# EasyEDA schematic Master System Converter Plus.json
TITLE: Sheet_1; REV: 1.0; Date: 2022-09-26; Sheet: 1/1; Drawn By: Pilou95; Company: Your Company
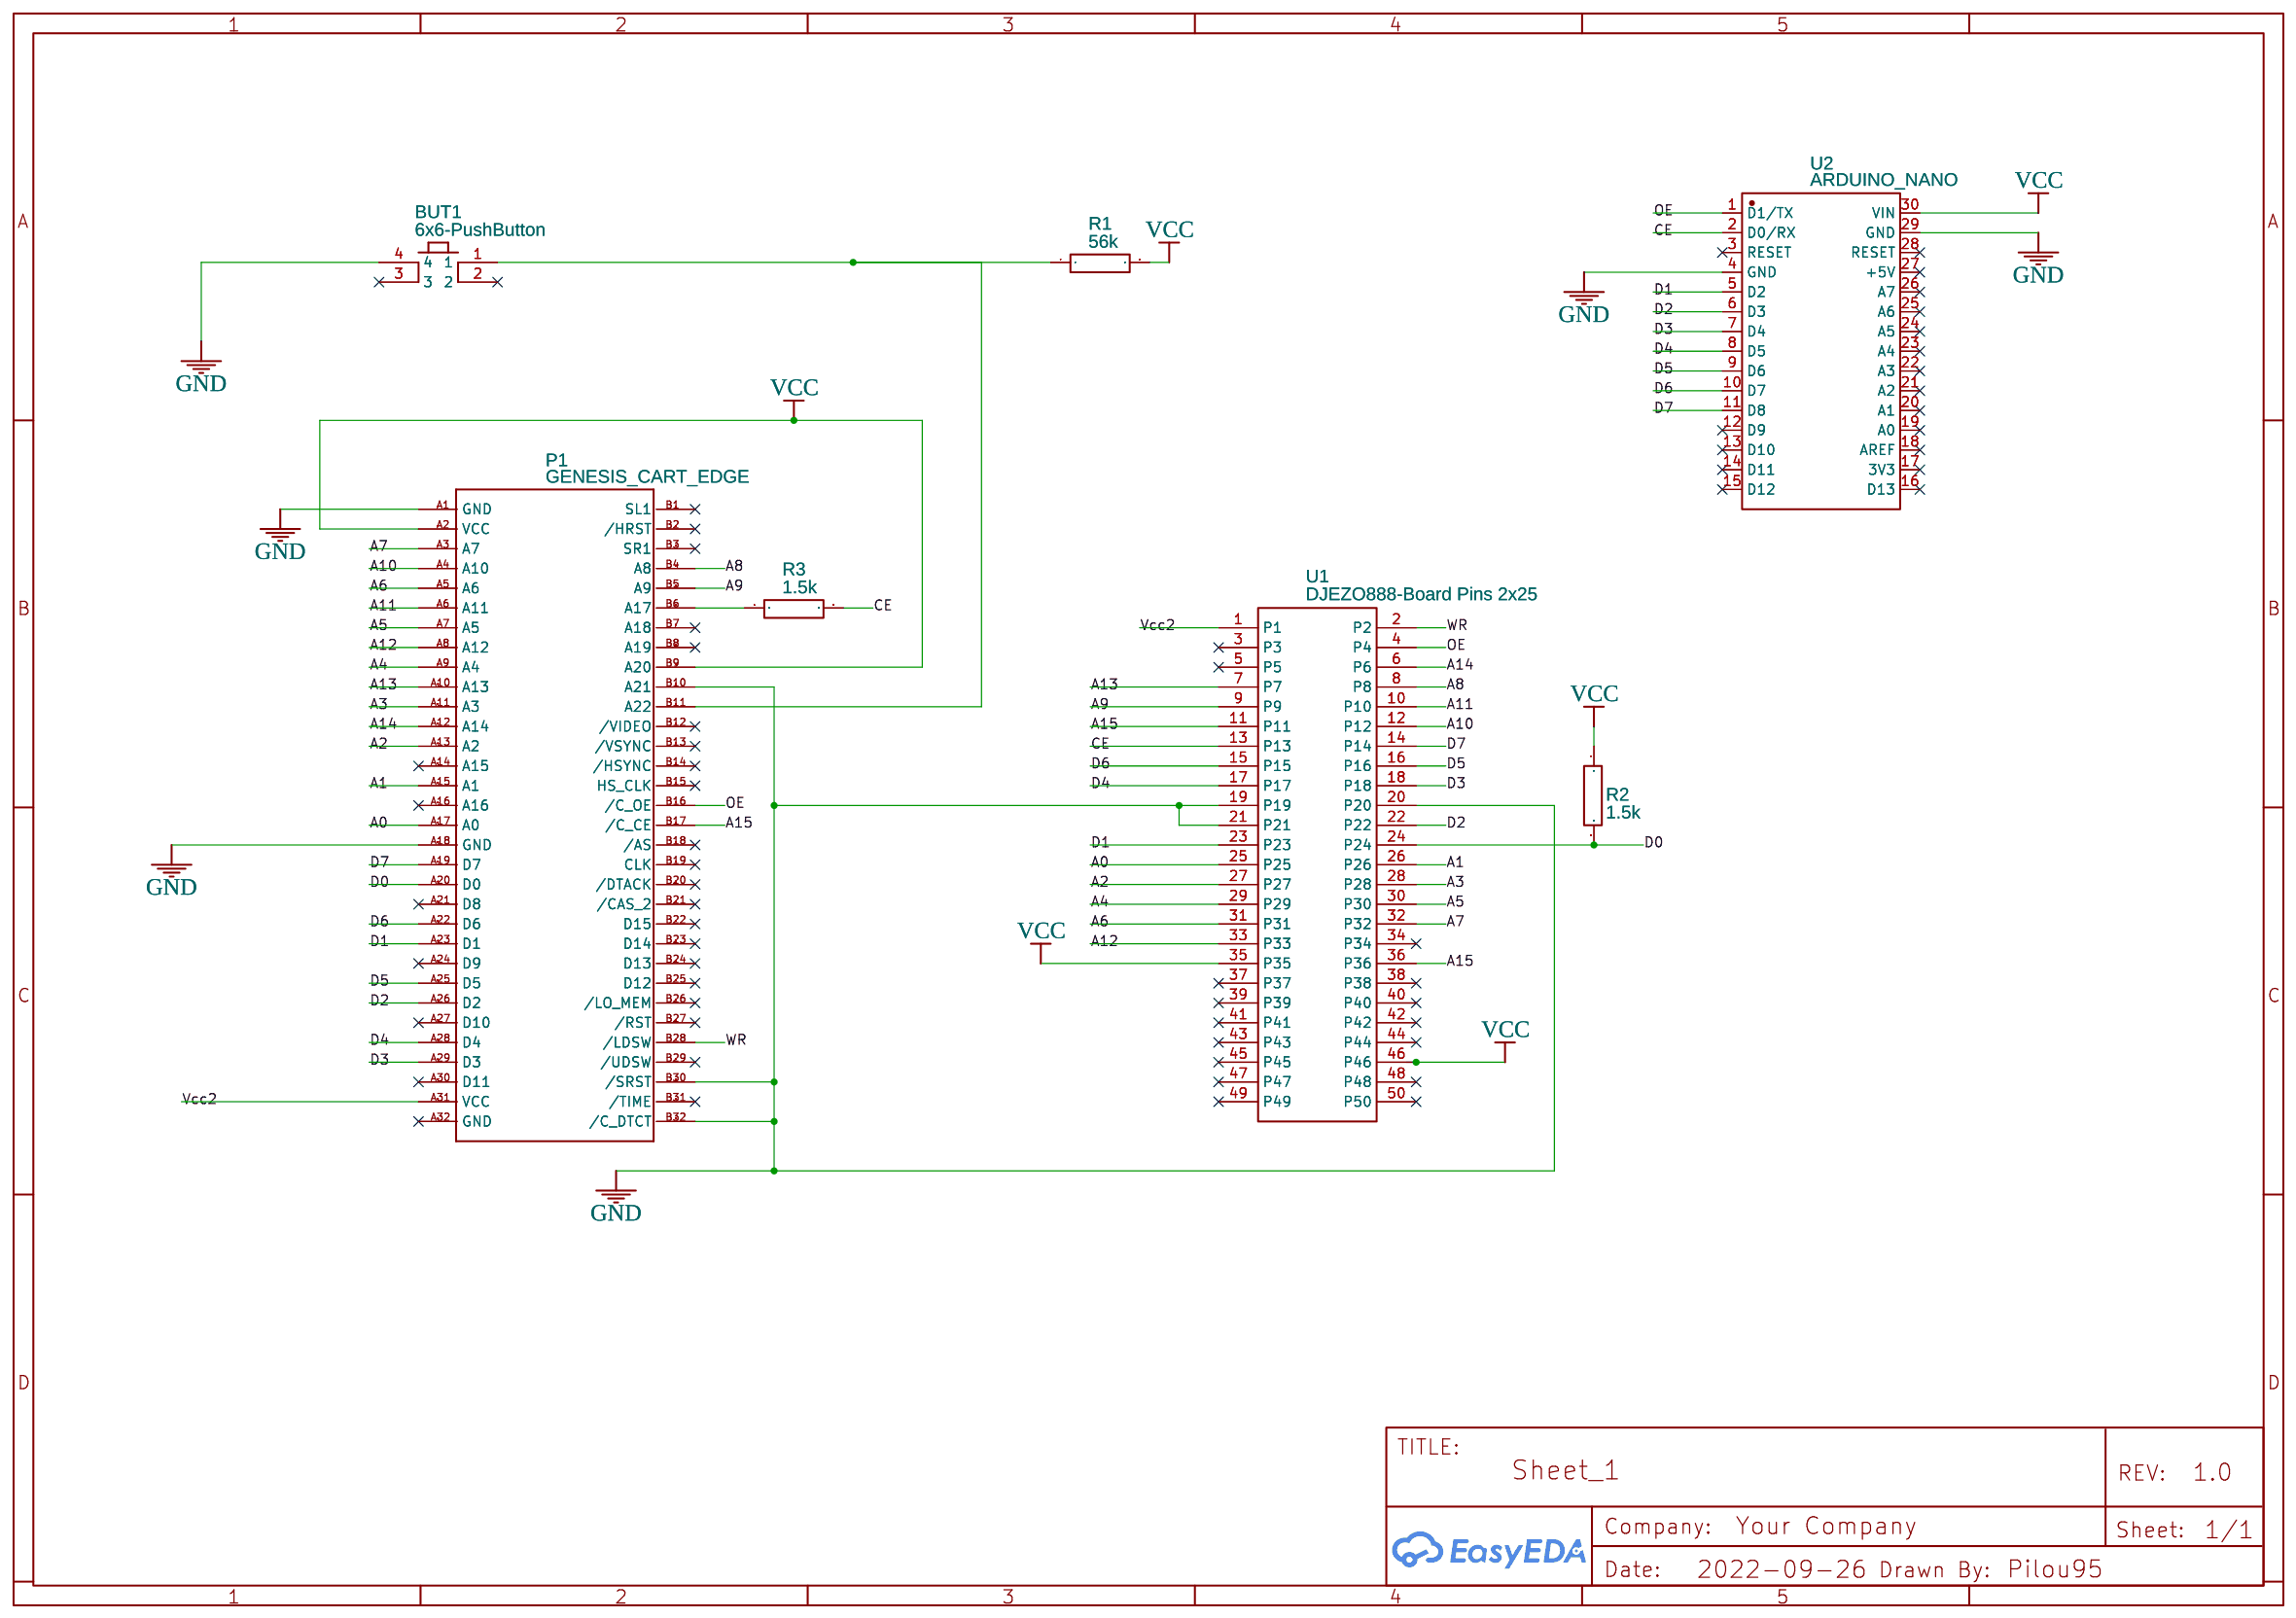
[diagram p0: schematic sheet]

## Parts
BUT1  6x6-PushButton  [6X6-PUSHBUTTON]
P1  GENESIS_CART_EDGE  [GENESIS_CART_EDGE]
R1  56k  [RESISTANCE]
R2  1.5k  [RESISTANCE]
R3  1.5k  [RESISTANCE]
U1  DJEZO888-Board Pins 2x25  [DJEZO888-2X25 CARD EDGE 2.54]
U2  ARDUINO_NANO  [COMM-TH_ARDUINO_NANO]

## Library data of the parts
BUT1 = 6x6-PushButton: Contributor: peinadolopezvictor
P1 = GENESIS_CART_EDGE: Contributor: Donie1704
R1-R3 = resistance: Contributor: ludoslash
U1 = DJEZO888-Board Pins 2x25: Contributor: djezo888
U2 = ARDUINO_NANO: Supplier: LCSC; Supplier Part: C9900017879; Manufacturer: null; JLCPCB Part Class: Extended Part; Contributor: lcsc

## Nets
GND: BUT1.4 P1.A1(GND) P1.A18(GND) P1.B10(A21) P1.B30(/SRST) P1.B32(/C_DTCT) U1.19(P19) U1.20(P20) U1.21(P21) U2.4(GND) U2.29(GND)
VCC: P1.A2(VCC) P1.B9(A20) R1.2 R2.1 U1.35(P35) U1.46(P46) U2.30(VIN)
Vcc2: P1.A31(VCC) U1.1(P1)
A0: P1.A17(A0) U1.25(P25)
A1: P1.A15(A1) U1.26(P26)
A2: P1.A13(A2) U1.27(P27)
A3: P1.A11(A3) U1.28(P28)
A4: P1.A9(A4) U1.29(P29)
A5: P1.A7(A5) U1.30(P30)
A6: P1.A5(A6) U1.31(P31)
A7: P1.A3(A7) U1.32(P32)
A8: P1.B4(A8) U1.8(P8)
A9: P1.B5(A9) U1.9(P9)
A10: P1.A4(A10) U1.12(P12)
A11: P1.A6(A11) U1.10(P10)
A12: P1.A8(A12) U1.33(P33)
A13: P1.A10(A13) U1.7(P7)
A14: P1.A12(A14) U1.6(P6)
A15: P1.B17(/C_CE) U1.11(P11) U1.36(P36)
CE: R3.2 U1.13(P13) U2.2(D0/RX)
D0: P1.A20(D0) R2.2 U1.24(P24)
D1: P1.A23(D1) U1.23(P23) U2.5(D2)
D2: P1.A26(D2) U1.22(P22) U2.6(D3)
D3: P1.A29(D3) U1.18(P18) U2.7(D4)
D4: P1.A28(D4) U1.17(P17) U2.8(D5)
D5: P1.A25(D5) U1.16(P16) U2.9(D6)
D6: P1.A22(D6) U1.15(P15) U2.10(D7)
D7: P1.A19(D7) U1.14(P14) U2.11(D8)
OE: P1.B16(/C_OE) U1.4(P4) U2.1(D1/TX)
WR: P1.B28(/LDSW) U1.2(P2)
Net-(BUT1-1): BUT1.1 P1.B11(A22) R1.1
Net-(P1-B6): P1.B6(A17) R3.1

Not connected (* = marked no-connect by the designer): BUT1 2* 3*; P1 A14(A15)* A16* A21(D8)* A24(D9)* A27(D10)* A30(D11)* A32(GND)* B1(SL1)* B2(/HRST)* B3(SR1)* B7(A18)* B8(A19)* B12(/VIDEO)* B13(/VSYNC)* B14(/HSYNC)* B15(HS_CLK)* B18(/AS)* B19(CLK)* B20(/DTACK)* B21(/CAS_2)* B22(D15)* B23(D14)* B24(D13)* B25(D12)* B26(/LO_MEM)* B27(/RST)* B29(/UDSW)* B31(/TIME)*; U1 3(P3)* 5(P5)* 34(P34)* 37(P37)* 38(P38)* 39(P39)* 40(P40)* 41(P41)* 42(P42)* 43(P43)* 44(P44)* 45(P45)* 47(P47)* 48(P48)* 49(P49)* 50(P50)*; U2 3(RESET)* 12(D9)* 13(D10)* 14(D11)* 15(D12)* 16(D13)* 17(3V3)* 18(AREF)* 19(A0)* 20(A1)* 21(A2)* 22(A3)* 23(A4)* 24(A5)* 25(A6)* 26(A7)* 27(+5V)* 28(RESET)*
